# EAGLE design RumiCarGen3-Sensor3 (EAGLE 9.5.2)
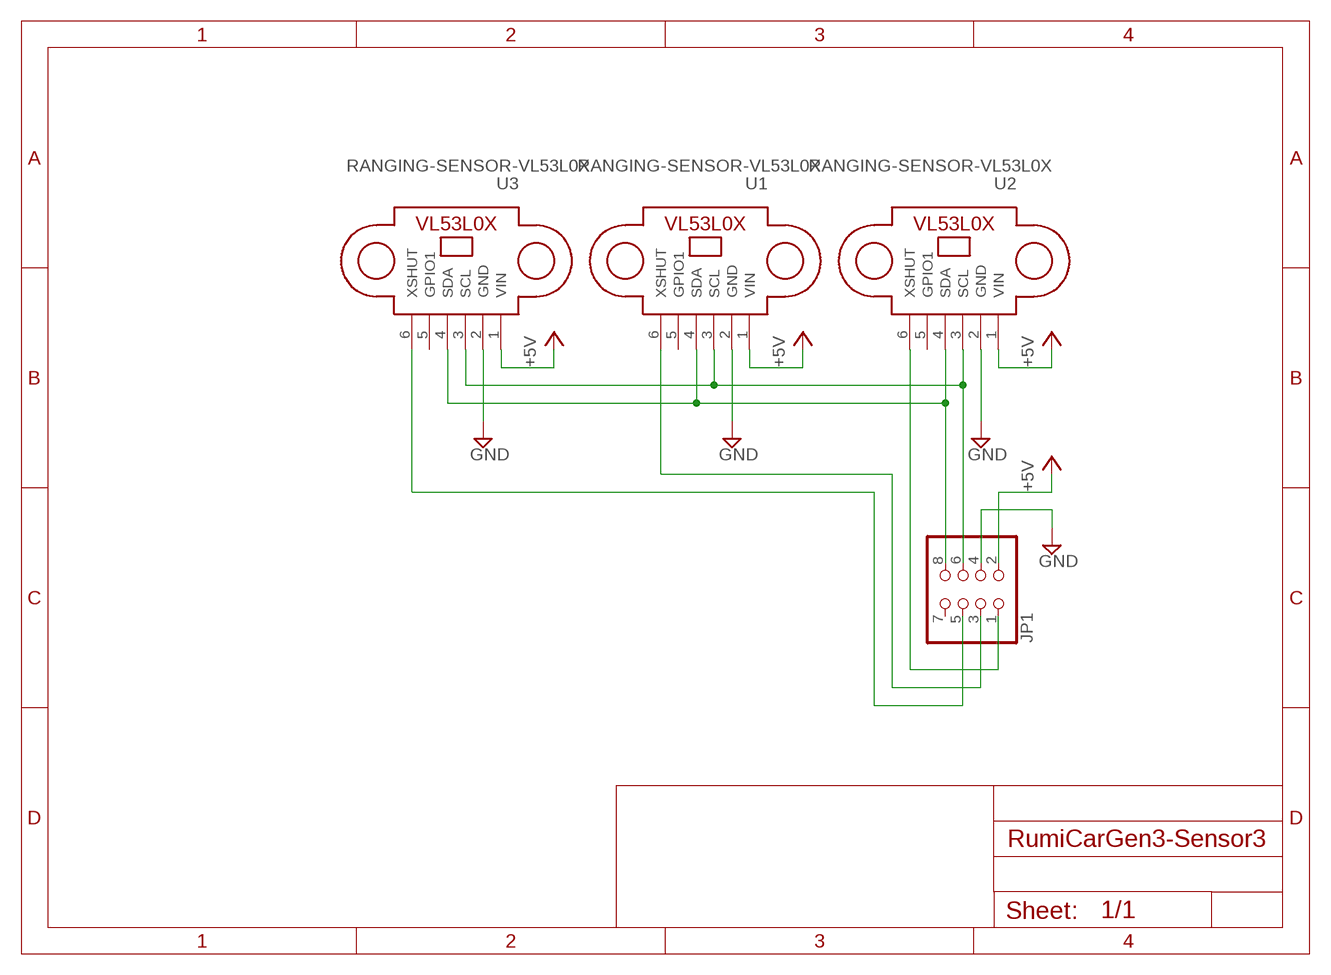
[diagram p0: schematic, sheet 1]

## Parts
JP1  PINHD-2X4  [2X04]
U1  RANGING-SENSOR-VL53L0X  [RANGING-SENSOR-VL53L0X]
U2  RANGING-SENSOR-VL53L0X  [RANGING-SENSOR-VL53L0X]
U3  RANGING-SENSOR-VL53L0X  [RANGING-SENSOR-VL53L0X]

## Nets
+5V: JP1.2 U1.1(VIN) U2.1(VIN) U3.1(VIN)
GND: JP1.4 U1.2(GND) U2.2(GND) U3.2(GND)
N$7: JP1.1 U2.6(XSHUT)
N$19: JP1.3 U1.6(XSHUT)
N$20: JP1.5 U3.6(XSHUT)
N$21: JP1.6 U1.3(SCL) U2.3(SCL) U3.3(SCL)
N$22: JP1.8 U1.4(SDA) U2.4(SDA) U3.4(SDA)
Unconnected: JP1.7 U1.5(GPIO1) U2.5(GPIO1) U3.5(GPIO1)

## Library data of the parts
JP1 = pinhead:PINHD-2X4: PIN HEADER
U1-U3 = diy-modules:RANGING-SENSOR-VL53L0X: Laser Ranging Sensor based on VL53L0X device More information about VL53L0X device can be found here: http://www.st.com/en/imaging-and-photonics-solutions/vl53l0x.html Arduino Library for VL53L0X is available here: https://github.com/pololu/vl53l0x-arduino Click here to find device on ebay.com <http://www.ebay.com/sch/GY+VL53L0X+module> Note: There are many variants. Search for the proper version.

## Board
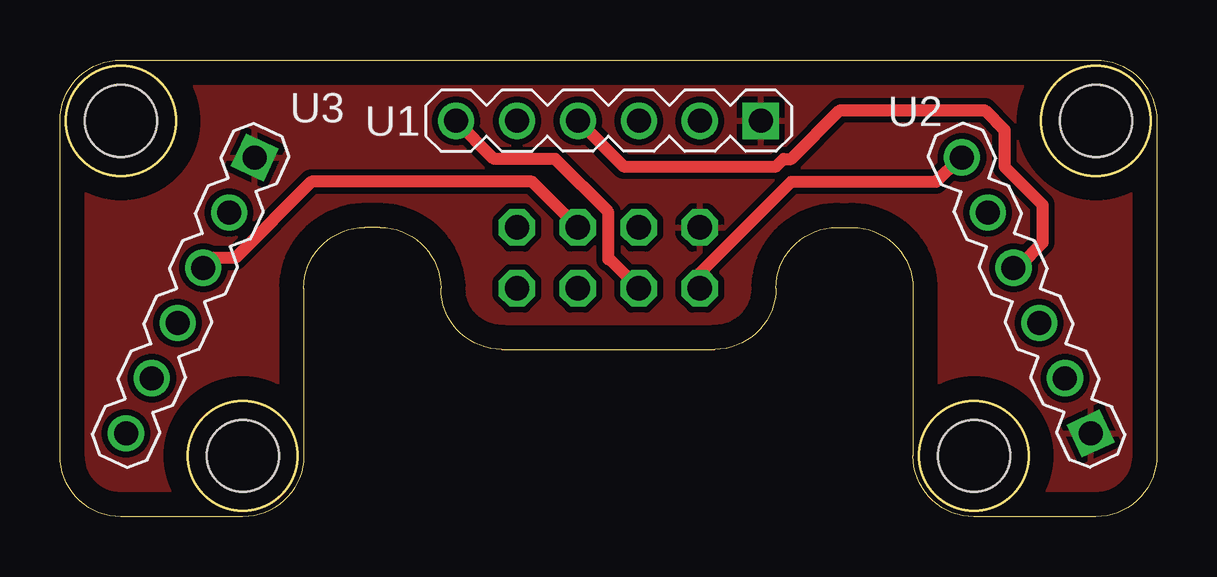
[diagram p1: board, top side]
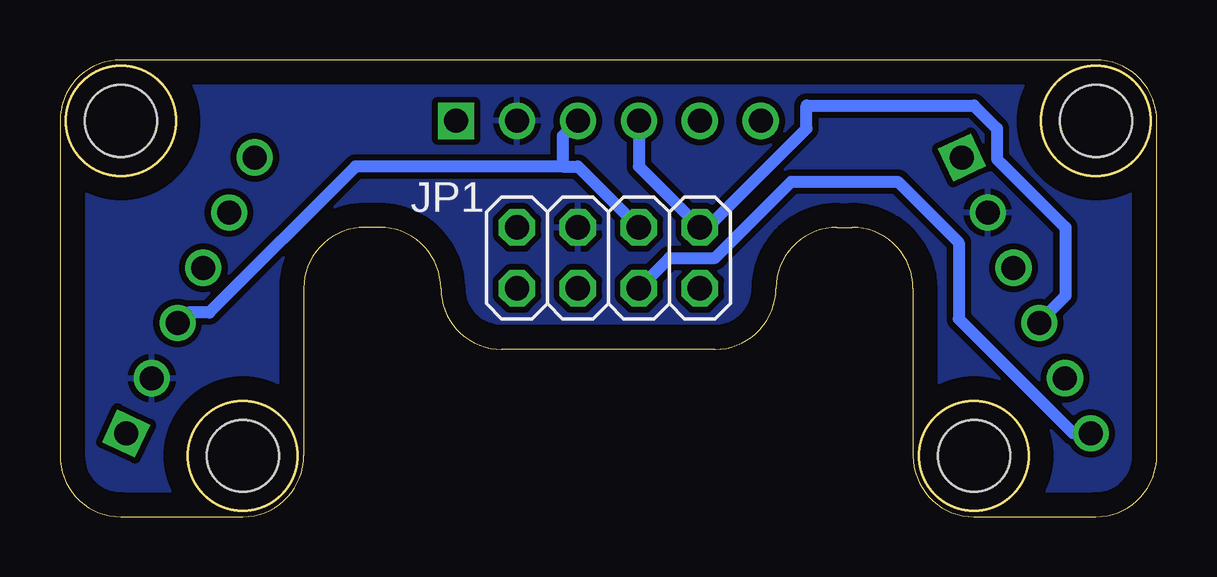
[diagram p2: board, bottom side, seen from below]

Size 45.72 x 19.05 mm. Coordinates in mm from the lower left corner, seen from the top.
Outline: 0,2.54 0,16.51 arc-90 2.54,19.05 43.18,19.05 arc-90 45.72,16.51 45.72,2.54 arc-90 43.18,0 38.1,0 arc-90 35.56,2.54 35.56,9.53 arc90 33.02,12.06 32.38,12.06 arc90 29.84,9.53 arc-90 27.3,6.99 18.41,6.99 arc-90 15.88,9.53 arc90 13.34,12.06 12.7,12.06 arc90 10.16,9.53 10.16,2.54 arc-90 7.62,0 2.54,0 arc-90 0,2.54
Outline: circle at 2.54,16.51 radius 2.29
Outline: circle at 43.18,16.51 radius 2.29
Outline: circle at 7.62,2.54 radius 2.29
Outline: circle at 38.1,2.54 radius 2.29
Copper layers (1*16): Top 0.035mm / dielectric 1.5mm / Bottom 0.035mm
Design rules "default *": minimum track width 20mil, minimum drill 0.35mm, track to track 10mil, track to pad 10mil, pad to pad 10mil, via to via 10mil, smd to smd 6mil, copper to edge 40mil, drill to drill 6mil, minimum pad ring 10mil, minimum via ring 8mil, stop-mask expansion 4mil, vias tented up to drill 0mil, thermal gap 10mil
Holes 3 mm at 7.62,2.54 2.54,16.51 43.18,16.51 38.1,2.54

### Footprints (pad centres in the part's own frame; a part is rotated, then mirrored left to right if it is on the bottom)
2X04 = drill 1.016 octagon: 1 -3.81,-1.27; 2 -3.81,1.27; 3 -1.27,-1.27; 4 -1.27,1.27; 5 1.27,-1.27; 6 1.27,1.27; 7 3.81,-1.27; 8 3.81,1.27
RANGING-SENSOR-VL53L0X = drill 1 square: 1 -3.81,6.35 | drill 1: 2 -3.81,3.81; 3 -3.81,1.27; 4 -3.81,-1.27; 5 -3.81,-3.81; 6 -3.81,-6.35

### Placement (x,y rotation side)
JP1  22.86,10.79 0 bottom
U1  22.86,12.7 270 top
U2  36.83,7.62 205 top
U3  8.89,7.62 335 top

### Tracks (layer width: path | path; a pad name or v marks a point on that pad's centre or on a via)
+5V
  pour Top: 0.64,18.41 0.64,0.64 9.53,0.64 9.53,10.79 11.43,12.7 14.61,12.7 16.51,10.79 16.51,7.62 29.21,7.62 29.21,10.79 31.11,12.7 34.29,12.7 36.2,10.79 36.2,0.64 45.09,0.64 45.09,18.41
GND
  pour Bottom: 0.64,18.41 0.64,0.64 9.53,0.64 9.53,10.79 11.43,12.7 14.61,12.7 16.51,10.79 16.51,7.62 29.21,7.62 29.21,10.79 31.11,12.7 34.29,12.7 36.2,10.79 36.2,0.64 45.09,0.64 45.09,18.41
N$7
  Top 0.508: JP1.1 26.67,10.16 30.48,13.97 36.51,13.97 37.47,14.92 U2.6
N$19
  Top 0.508: U1.6 18.1,14.92 20.64,14.92 22.86,12.7 22.86,10.73 22.92,10.73 JP1.3
N$20
  Bottom 0.508: JP1.5 20.32,10.79 18.41,10.79 15.24,13.97 10.79,13.97 8.26,11.43 8.26,8.26 3.49,3.49 2.86,3.49 U3.6
N$21
  Top 0.508: JP1.6 19.68,13.97 10.48,13.97 7.3,10.79 6.35,10.79 6.03,10.48 U3.3
  Bottom 0.508: 24.77,14.61 33.4,14.61 39.5,8.51 40.38,8.51 U2.3 | 24.77,14.61 24.77,15.88 U1.3 | JP1.6 24.13,14.61 24.77,14.61
N$22
  Top 0.508: U1.4 23.5,14.61 29.84,14.61 30.16,14.92 30.48,14.92 32.51,16.95 38.54,16.95 39.37,16.13 39.37,14.61 40.96,13.02 40.96,11.43 40.01,10.48 U2.4
  Bottom 0.508: U3.4 4.76,8.26 3.81,9.21 3.81,12.06 6.67,14.92 6.67,16.19 7.62,17.14 14.61,17.14 14.61,16.19 18.73,12.06 JP1.8 21.59,14.61 U1.4